# Altium schematic sheet CapacitorLadder.SchDoc
size A4
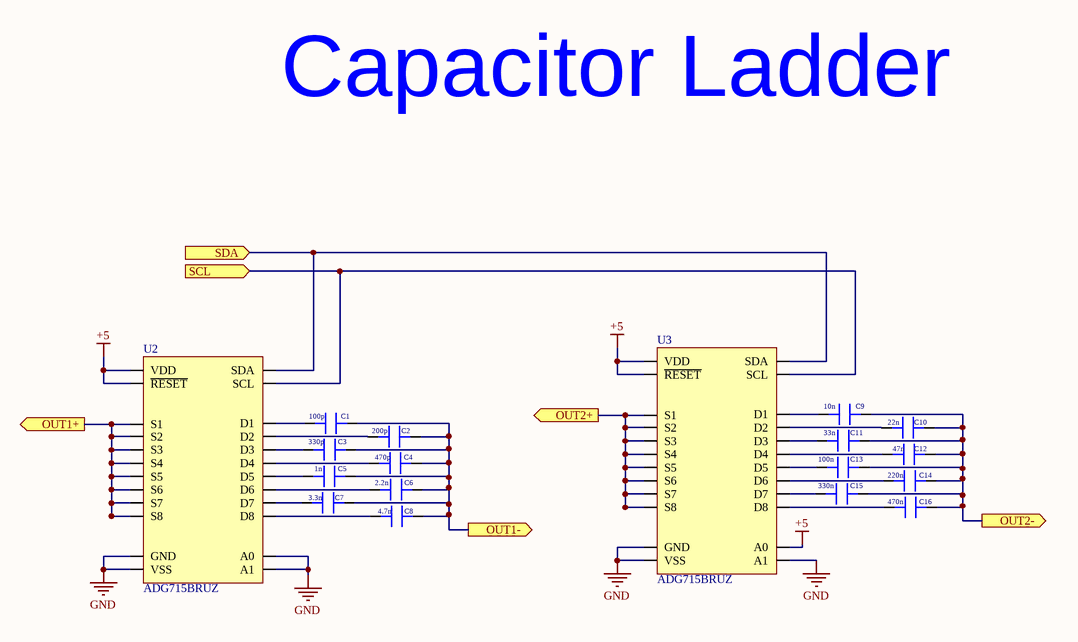
[diagram p0: CapacitorLadder.SchDoc]

## Parts
C1  100p  [C0805]
C2  200p  [C0805]
C3  330p  [C0805]
C4  470p  [C0805]
C5  1n  [C0805]
C6  2.2n  [C0805]
C7  3.3n  [C0805]
C8  4.7n  [C0805]
C9  10n  [C0805]
C10  22n  [C0805]
C11  33n  [C0805]
C12  47n  [C0805]
C13  100n  [C0805]
C14  220n  [C0805]
C15  330n  [C0805]
C16  470n  [C0805]
U2  ADG715BRUZ  [ADG715BRUZ]
U3  ADG715BRUZ  [ADG715BRUZ]

## Ports
OUT1+ (out), OUT1- (out), OUT2+ (out), OUT2- (out), SCL (in), SDA (in)

## Nets
+5: U2.2(VDD) U2.23(~{RESET}) U3.2(VDD) U3.23(~{RESET}) U3.24(A0)
GND: U2.4(GND) U2.21(VSS) U2.22(A1) U2.24(A0) U3.4(GND) U3.21(VSS) U3.22(A1)
OUT1+: U2.5(S1) U2.7(S2) U2.9(S3) U2.11(S4) U2.14(S5) U2.16(S6) U2.18(S7) U2.20(S8) ; port OUT1+
OUT1-: C1.2 C2.2 C3.2 C4.2 C5.2 C6.2 C7.2 C8.2 ; port OUT1-
OUT2+: U3.5(S1) U3.7(S2) U3.9(S3) U3.11(S4) U3.14(S5) U3.16(S6) U3.18(S7) U3.20(S8) ; port OUT2+
OUT2-: C9.2 C10.2 C11.2 C12.2 C13.2 C14.2 C15.2 C16.2 ; port OUT2-
SCL: U2.1(SCL) U3.1(SCL) ; port SCL
SDA: U2.3(SDA) U3.3(SDA) ; port SDA
NetC1_1: C1.1 U2.6(D1)
NetC2_1: C2.1 U2.8(D2)
NetC3_1: C3.1 U2.10(D3)
NetC4_1: C4.1 U2.12(D4)
NetC5_1: C5.1 U2.13(D5)
NetC6_1: C6.1 U2.15(D6)
NetC7_1: C7.1 U2.17(D7)
NetC8_1: C8.1 U2.19(D8)
NetC9_1: C9.1 U3.6(D1)
NetC10_1: C10.1 U3.8(D2)
NetC11_1: C11.1 U3.10(D3)
NetC12_1: C12.1 U3.12(D4)
NetC13_1: C13.1 U3.13(D5)
NetC14_1: C14.1 U3.15(D6)
NetC15_1: C15.1 U3.17(D7)
NetC16_1: C16.1 U3.19(D8)

## Notes on the sheet
- Capacitor Ladder
- Title
- Size:
- Date:
- A4
- Number:
- Time:
- Revision:
- Sheet
- of
- File:

## Library data of the parts
C1 = C805_100p
C2 = C805_200p
C3 = C805_330p
C4 = C805_470p
C5 = C805_1n
C6 = C805_2.2n
C7 = C805_3.3n
C8 = C805_4.7n
C9 = C805_10n
C10 = C805_22n
C11 = C805_33n
C12 = C805_47n
C13 = C805_100n
C14 = C805_220n
C15 = C805_330n
C16 = C805_470n
U2 U3 = ADG715BRUZ: ANALOG DEVICES         ADG715BRUZ            Analogue Switch, Octal Channel, SPST, 8 Channels, 4.5 ohm, 2.7V to 5.5V, TSSOP, 24 Pins; Number of Channels: 8; Bandwidth: 155MHz; Drain to Source Resistance: 2.5R; Nominal Supply Current: 20uA; Max Power Dissipation: 125uW; Interface: Serial; Dual Supply Voltage: 2.5V; On-State Resistance: 4.5R; Turn-On Delay Time: 140ns; Turn-Off Delay Time: 130ns; Operating Supply Current: 10uA; High Level Output Current: 30mA; Supply Type: Single,Dual; Max Dual Supply Voltage: 2.75V; Min Dual Supply Voltage: 2.25V; Supplier 1: Digi-Key; Manufacturer: Analog Devices; Manufacturer Part Number: ADG715BRUZ; Stock 1: 3027; Case/Package: TSSOP; Number of Pins: 24; Contact Plating: Tin,Matte; Min Operating Temperature: -40°C; Max Operating Temperature: 85°C; Throw Configuration: SPST; Number of Bits: 8; Min Supply Voltage: 2.7V; Max Supply Voltage: 5.5V; Number of Inputs: 8; Number of Outputs: 8; Package Quantity: 62; Packaging: Rail/Tube; Number of Circuits: 8; -3db Bandwidth: 155MHz; Max Supply Current: 20uA; Power Dissipation: 125uW; Length: 7.8mm; Height: 1.05mm; Width: 4.4mm; Radiation Hardening: No; REACH SVHC: No SVHC; Lead Free: Contains Lead; ComponentLink1URL: https://datasheet.ciiva.com/2978/adg714-715-2978656.pdf; ComponentLink1Description: https://datasheet.ciiva.com/2978/adg714-715-2978656.pdf; ComponentLink2URL: https://datasheet.ciiva.com/1668/adg714-715-1668978.pdf; ComponentLink2Description: https://datasheet.ciiva.com/1668/adg714-715-1668978.pdf; ComponentLink3URL: https://datasheet.ciiva.com/15127/getdatasheetpartid-123058-15127194.pdf; ComponentLink3Description: https://datasheet.ciiva.com/15127/getdatasheetpartid-123058-15127194.pdf; ComponentLink4URL: https://datasheet.ciiva.com/16637/adg714-715-16637994.pdf; ComponentLink4Description: https://datasheet.ciiva.com/16637/adg714-715-16637994.pdf; ComponentLink5URL: https://datasheet.ciiva.com/5797/adg714-715-5797179.pdf; ComponentLink5Description: https://datasheet.ciiva.com/5797/adg714-715-5797179.pdf; ComponentLink6URL: https://datasheet.ciiva.com/48708/001248020-da-01-en-ic-switch-octal-adg715bruz-tssop-24-adi-48708535.pdf; ComponentLink6Description: https://datasheet.ciiva.com/48708/001248020-da-01-en-ic-switch-octal-adg715bruz-tssop-24-adi-48708535.pdf; Supplier Part Number 1: ADG715BRUZ-ND; Pricing 1: 1=6.12, 62=5.19758, 124=4.50452, 558=3.83461, 1054=3.234 (USD)